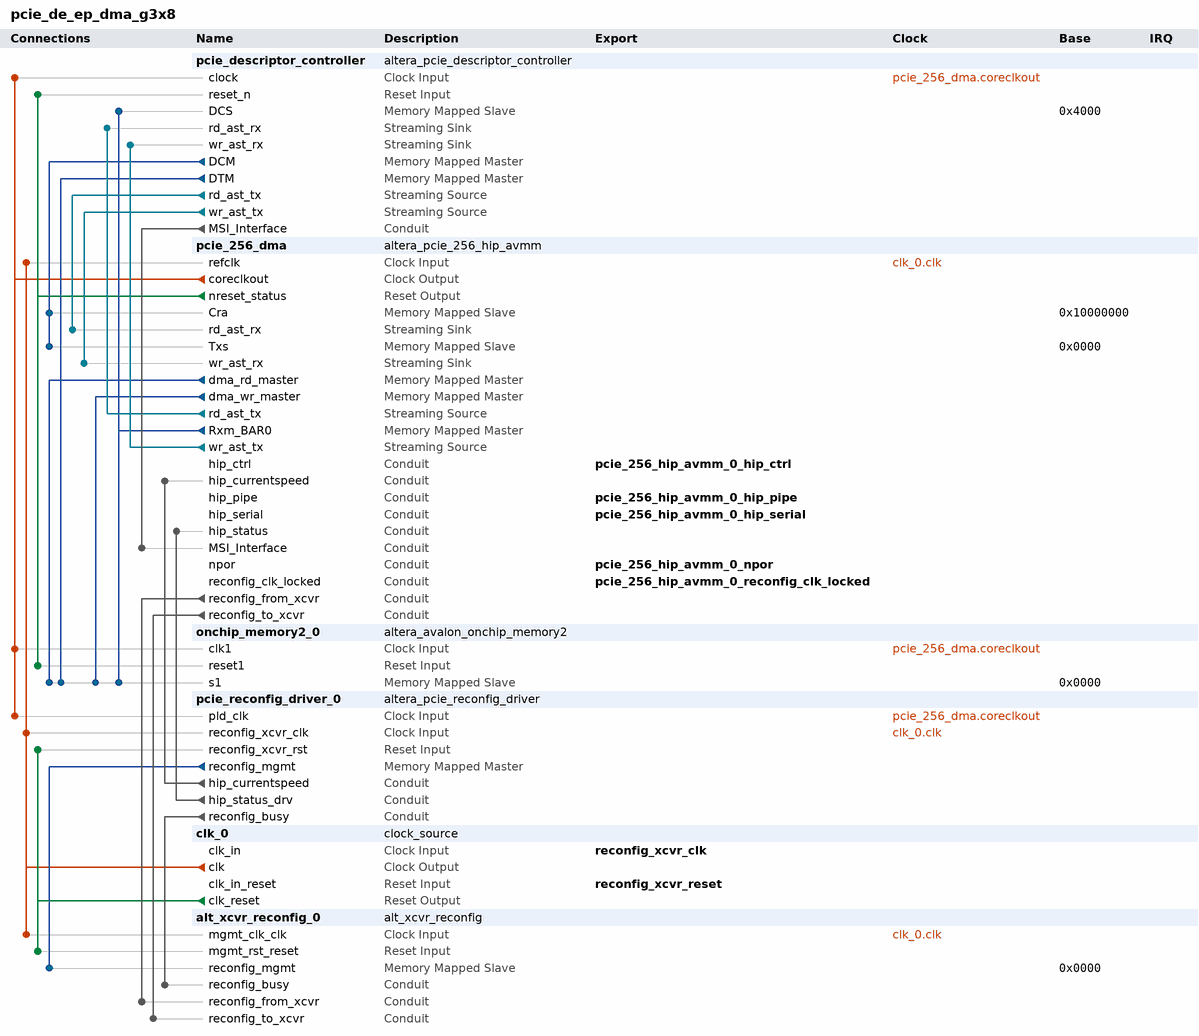
[diagram p0: system contents]
# Platform Designer (Qsys) system pcie_de_ep_dma_g3x8, Stratix V Unknown
# Parameters at their usual value, and those the tool derives, are not listed.
package require -exact qsys 13.1
create_system pcie_de_ep_dma_g3x8
set_project_property DEVICE_FAMILY {Stratix V}
set_project_property DEVICE Unknown

add_instance pcie_descriptor_controller altera_pcie_descriptor_controller 1.0

add_instance pcie_256_dma altera_pcie_256_hip_avmm 13.1
set_instance_parameter_value pcie_256_dma pcie_qsys 1
set_instance_parameter_value pcie_256_dma lane_mask_hwtcl x8
set_instance_parameter_value pcie_256_dma gen123_lane_rate_mode_hwtcl {Gen3 (8.0 Gbps)}
set_instance_parameter_value pcie_256_dma port_type_hwtcl {Native endpoint}
set_instance_parameter_value pcie_256_dma rxbuffer_rxreq_hwtcl Low
set_instance_parameter_value pcie_256_dma pll_refclk_freq_hwtcl {100 MHz}
set_instance_parameter_value pcie_256_dma set_pld_clk_x1_625MHz_hwtcl 0
set_instance_parameter_value pcie_256_dma in_cvp_mode_hwtcl 0
set_instance_parameter_value pcie_256_dma enable_tl_only_sim_hwtcl 0
set_instance_parameter_value pcie_256_dma use_atx_pll_hwtcl 0
set_instance_parameter_value pcie_256_dma SLAVE_ADDRESS_MAP_0 15
set_instance_parameter_value pcie_256_dma CB_P2A_AVALON_ADDR_B0 0x00000000
set_instance_parameter_value pcie_256_dma SLAVE_ADDRESS_MAP_1 0
set_instance_parameter_value pcie_256_dma CB_P2A_AVALON_ADDR_B1 0x00000000
set_instance_parameter_value pcie_256_dma SLAVE_ADDRESS_MAP_2 0
set_instance_parameter_value pcie_256_dma CB_P2A_AVALON_ADDR_B2 0x00000000
set_instance_parameter_value pcie_256_dma SLAVE_ADDRESS_MAP_3 0
set_instance_parameter_value pcie_256_dma CB_P2A_AVALON_ADDR_B3 0x00000000
set_instance_parameter_value pcie_256_dma SLAVE_ADDRESS_MAP_4 0
set_instance_parameter_value pcie_256_dma CB_P2A_AVALON_ADDR_B4 0x00000000
set_instance_parameter_value pcie_256_dma SLAVE_ADDRESS_MAP_5 0
set_instance_parameter_value pcie_256_dma CB_P2A_AVALON_ADDR_B5 0x00000000
set_instance_parameter_value pcie_256_dma RD_SLAVE_ADDRESS_MAP 14
set_instance_parameter_value pcie_256_dma WR_SLAVE_ADDRESS_MAP 14
set_instance_parameter_value pcie_256_dma NUM_PREFETCH_MASTERS 1
set_instance_parameter_value pcie_256_dma bar0_type_hwtcl 64
set_instance_parameter_value pcie_256_dma bar1_type_hwtcl 1
set_instance_parameter_value pcie_256_dma bar2_type_hwtcl 1
set_instance_parameter_value pcie_256_dma bar3_type_hwtcl 1
set_instance_parameter_value pcie_256_dma bar4_type_hwtcl 1
set_instance_parameter_value pcie_256_dma bar5_type_hwtcl 1
set_instance_parameter_value pcie_256_dma fixed_address_mode 0
set_instance_parameter_value pcie_256_dma CB_P2A_FIXED_AVALON_ADDR_B0 0
set_instance_parameter_value pcie_256_dma CB_P2A_FIXED_AVALON_ADDR_B1 0
set_instance_parameter_value pcie_256_dma CB_P2A_FIXED_AVALON_ADDR_B2 0
set_instance_parameter_value pcie_256_dma CB_P2A_FIXED_AVALON_ADDR_B3 0
set_instance_parameter_value pcie_256_dma CB_P2A_FIXED_AVALON_ADDR_B4 0
set_instance_parameter_value pcie_256_dma CB_P2A_FIXED_AVALON_ADDR_B5 0
set_instance_parameter_value pcie_256_dma vendor_id_hwtcl 0
set_instance_parameter_value pcie_256_dma device_id_hwtcl 1
set_instance_parameter_value pcie_256_dma revision_id_hwtcl 1
set_instance_parameter_value pcie_256_dma class_code_hwtcl 0
set_instance_parameter_value pcie_256_dma subsystem_vendor_id_hwtcl 0
set_instance_parameter_value pcie_256_dma subsystem_device_id_hwtcl 0
set_instance_parameter_value pcie_256_dma max_payload_size_hwtcl 128
set_instance_parameter_value pcie_256_dma extend_tag_field_hwtcl 32
set_instance_parameter_value pcie_256_dma completion_timeout_hwtcl ABCD
set_instance_parameter_value pcie_256_dma enable_completion_timeout_disable_hwtcl 1
set_instance_parameter_value pcie_256_dma use_aer_hwtcl 0
set_instance_parameter_value pcie_256_dma ecrc_check_capable_hwtcl 0
set_instance_parameter_value pcie_256_dma ecrc_gen_capable_hwtcl 0
set_instance_parameter_value pcie_256_dma use_crc_forwarding_hwtcl 0
set_instance_parameter_value pcie_256_dma port_link_number_hwtcl 1
set_instance_parameter_value pcie_256_dma dll_active_report_support_hwtcl 0
set_instance_parameter_value pcie_256_dma surprise_down_error_support_hwtcl 0
set_instance_parameter_value pcie_256_dma slotclkcfg_hwtcl 1
set_instance_parameter_value pcie_256_dma msi_multi_message_capable_hwtcl 1
set_instance_parameter_value pcie_256_dma msi_64bit_addressing_capable_hwtcl true
set_instance_parameter_value pcie_256_dma msi_masking_capable_hwtcl false
set_instance_parameter_value pcie_256_dma msi_support_hwtcl true
set_instance_parameter_value pcie_256_dma enable_function_msix_support_hwtcl 0
set_instance_parameter_value pcie_256_dma msix_table_size_hwtcl 0
set_instance_parameter_value pcie_256_dma msix_table_offset_hwtcl 0
set_instance_parameter_value pcie_256_dma msix_table_bir_hwtcl 0
set_instance_parameter_value pcie_256_dma msix_pba_offset_hwtcl 0
set_instance_parameter_value pcie_256_dma msix_pba_bir_hwtcl 0
set_instance_parameter_value pcie_256_dma enable_slot_register_hwtcl 0
set_instance_parameter_value pcie_256_dma slot_power_scale_hwtcl 0
set_instance_parameter_value pcie_256_dma slot_power_limit_hwtcl 0
set_instance_parameter_value pcie_256_dma slot_number_hwtcl 0
set_instance_parameter_value pcie_256_dma endpoint_l0_latency_hwtcl 0
set_instance_parameter_value pcie_256_dma endpoint_l1_latency_hwtcl 0
set_instance_parameter_value pcie_256_dma CG_COMMON_CLOCK_MODE 1
set_instance_parameter_value pcie_256_dma avmm_width_hwtcl 256
set_instance_parameter_value pcie_256_dma CG_RXM_IRQ_NUM 16
set_instance_parameter_value pcie_256_dma TX_S_ADDR_WIDTH 28
set_instance_parameter_value pcie_256_dma use_rx_st_be_hwtcl 0
set_instance_parameter_value pcie_256_dma use_ast_parity 0
set_instance_parameter_value pcie_256_dma hip_reconfig_hwtcl 0
set_instance_parameter_value pcie_256_dma vsec_id_hwtcl 40960
set_instance_parameter_value pcie_256_dma vsec_rev_hwtcl 0
set_instance_parameter_value pcie_256_dma expansion_base_address_register_hwtcl 0
set_instance_parameter_value pcie_256_dma io_window_addr_width_hwtcl 0
set_instance_parameter_value pcie_256_dma prefetchable_mem_window_addr_width_hwtcl 0
set_instance_parameter_value pcie_256_dma advanced_default_parameter_override 0
set_instance_parameter_value pcie_256_dma override_tbpartner_driver_setting_hwtcl 0
set_instance_parameter_value pcie_256_dma override_rxbuffer_cred_preset 0
set_instance_parameter_value pcie_256_dma gen3_rxfreqlock_counter_hwtcl 0
set_instance_parameter_value pcie_256_dma force_hrc 0
set_instance_parameter_value pcie_256_dma force_src 0
set_instance_parameter_value pcie_256_dma serial_sim_hwtcl 1
set_instance_parameter_value pcie_256_dma advanced_default_hwtcl_bypass_cdc false
set_instance_parameter_value pcie_256_dma advanced_default_hwtcl_enable_rx_buffer_checking false
set_instance_parameter_value pcie_256_dma advanced_default_hwtcl_disable_link_x2_support false
set_instance_parameter_value pcie_256_dma advanced_default_hwtcl_wrong_device_id disable
set_instance_parameter_value pcie_256_dma advanced_default_hwtcl_data_pack_rx disable
set_instance_parameter_value pcie_256_dma advanced_default_hwtcl_ltssm_1ms_timeout disable
set_instance_parameter_value pcie_256_dma advanced_default_hwtcl_ltssm_freqlocked_check disable
set_instance_parameter_value pcie_256_dma advanced_default_hwtcl_deskew_comma com_deskw
set_instance_parameter_value pcie_256_dma advanced_default_hwtcl_device_number 0
set_instance_parameter_value pcie_256_dma advanced_default_hwtcl_pipex1_debug_sel disable
set_instance_parameter_value pcie_256_dma advanced_default_hwtcl_pclk_out_sel pclk
set_instance_parameter_value pcie_256_dma advanced_default_hwtcl_no_soft_reset false
set_instance_parameter_value pcie_256_dma advanced_default_hwtcl_maximum_current 0
set_instance_parameter_value pcie_256_dma advanced_default_hwtcl_d1_support false
set_instance_parameter_value pcie_256_dma advanced_default_hwtcl_d2_support false
set_instance_parameter_value pcie_256_dma advanced_default_hwtcl_d0_pme false
set_instance_parameter_value pcie_256_dma advanced_default_hwtcl_d1_pme false
set_instance_parameter_value pcie_256_dma advanced_default_hwtcl_d2_pme false
set_instance_parameter_value pcie_256_dma advanced_default_hwtcl_d3_hot_pme false
set_instance_parameter_value pcie_256_dma advanced_default_hwtcl_d3_cold_pme false
set_instance_parameter_value pcie_256_dma advanced_default_hwtcl_low_priority_vc single_vc
set_instance_parameter_value pcie_256_dma advanced_default_hwtcl_disable_snoop_packet false
set_instance_parameter_value pcie_256_dma advanced_default_hwtcl_enable_l1_aspm false
set_instance_parameter_value pcie_256_dma advanced_default_hwtcl_set_l0s 0
set_instance_parameter_value pcie_256_dma advanced_default_hwtcl_l1_exit_latency_sameclock 0
set_instance_parameter_value pcie_256_dma advanced_default_hwtcl_l1_exit_latency_diffclock 0
set_instance_parameter_value pcie_256_dma advanced_default_hwtcl_hot_plug_support 0
set_instance_parameter_value pcie_256_dma advanced_default_hwtcl_extended_tag_reset false
set_instance_parameter_value pcie_256_dma advanced_default_hwtcl_no_command_completed true
set_instance_parameter_value pcie_256_dma advanced_default_hwtcl_interrupt_pin inta
set_instance_parameter_value pcie_256_dma advanced_default_hwtcl_bridge_port_vga_enable false
set_instance_parameter_value pcie_256_dma advanced_default_hwtcl_bridge_port_ssid_support false
set_instance_parameter_value pcie_256_dma advanced_default_hwtcl_ssvid 0
set_instance_parameter_value pcie_256_dma advanced_default_hwtcl_ssid 0
set_instance_parameter_value pcie_256_dma advanced_default_hwtcl_eie_before_nfts_count 4
set_instance_parameter_value pcie_256_dma advanced_default_hwtcl_gen2_diffclock_nfts_count 255
set_instance_parameter_value pcie_256_dma advanced_default_hwtcl_gen2_sameclock_nfts_count 255
set_instance_parameter_value pcie_256_dma advanced_default_hwtcl_l0_exit_latency_sameclock 6
set_instance_parameter_value pcie_256_dma advanced_default_hwtcl_l0_exit_latency_diffclock 6
set_instance_parameter_value pcie_256_dma advanced_default_hwtcl_atomic_op_routing false
set_instance_parameter_value pcie_256_dma advanced_default_hwtcl_atomic_op_completer_32bit false
set_instance_parameter_value pcie_256_dma advanced_default_hwtcl_atomic_op_completer_64bit false
set_instance_parameter_value pcie_256_dma advanced_default_hwtcl_cas_completer_128bit false
set_instance_parameter_value pcie_256_dma advanced_default_hwtcl_ltr_mechanism false
set_instance_parameter_value pcie_256_dma advanced_default_hwtcl_tph_completer false
set_instance_parameter_value pcie_256_dma advanced_default_hwtcl_extended_format_field false
set_instance_parameter_value pcie_256_dma advanced_default_hwtcl_atomic_malformed true
set_instance_parameter_value pcie_256_dma advanced_default_hwtcl_flr_capability false
set_instance_parameter_value pcie_256_dma advanced_default_hwtcl_enable_adapter_half_rate_mode false
set_instance_parameter_value pcie_256_dma advanced_default_hwtcl_vc0_clk_enable true
set_instance_parameter_value pcie_256_dma advanced_default_hwtcl_register_pipe_signals false
set_instance_parameter_value pcie_256_dma advanced_default_hwtcl_skp_os_gen3_count 0
set_instance_parameter_value pcie_256_dma advanced_default_hwtcl_tx_cdc_almost_empty 5
set_instance_parameter_value pcie_256_dma advanced_default_hwtcl_rx_l0s_count_idl 0
set_instance_parameter_value pcie_256_dma advanced_default_hwtcl_cdc_dummy_insert_limit 11
set_instance_parameter_value pcie_256_dma advanced_default_hwtcl_ei_delay_powerdown_count 10
set_instance_parameter_value pcie_256_dma advanced_default_hwtcl_skp_os_schedule_count 0
set_instance_parameter_value pcie_256_dma advanced_default_hwtcl_fc_init_timer 1024
set_instance_parameter_value pcie_256_dma advanced_default_hwtcl_l01_entry_latency 31
set_instance_parameter_value pcie_256_dma advanced_default_hwtcl_flow_control_update_count 30
set_instance_parameter_value pcie_256_dma advanced_default_hwtcl_flow_control_timeout_count 200
set_instance_parameter_value pcie_256_dma advanced_default_hwtcl_retry_buffer_last_active_address 2047
set_instance_parameter_value pcie_256_dma advanced_default_hwtcl_reserved_debug 0

add_instance onchip_memory2_0 altera_avalon_onchip_memory2 13.1
set_instance_parameter_value onchip_memory2_0 dataWidth 256
set_instance_parameter_value onchip_memory2_0 dualPort false
set_instance_parameter_value onchip_memory2_0 initMemContent false
set_instance_parameter_value onchip_memory2_0 initializationFileName onchip_mem
set_instance_parameter_value onchip_memory2_0 memorySize 16384

add_instance pcie_reconfig_driver_0 altera_pcie_reconfig_driver 1.0
set_instance_parameter_value pcie_reconfig_driver_0 gen123_lane_rate_mode_hwtcl {Gen3 (8.0 Gbps)}
set_instance_parameter_value pcie_reconfig_driver_0 number_of_reconfig_interfaces 11

add_instance clk_0 clock_source 13.1
set_instance_parameter_value clk_0 clockFrequency 100000000

add_instance alt_xcvr_reconfig_0 alt_xcvr_reconfig 13.1
set_instance_parameter_value alt_xcvr_reconfig_0 device_family {Stratix V}
set_instance_parameter_value alt_xcvr_reconfig_0 number_of_reconfig_interfaces 11
set_instance_parameter_value alt_xcvr_reconfig_0 enable_analog 1
set_instance_parameter_value alt_xcvr_reconfig_0 enable_adce 1

# connections
add_connection clk_0.clk alt_xcvr_reconfig_0.mgmt_clk_clk clock
add_connection clk_0.clk pcie_256_dma.refclk clock
add_connection clk_0.clk pcie_reconfig_driver_0.reconfig_xcvr_clk clock
add_connection pcie_256_dma.coreclkout onchip_memory2_0.clk1 clock
add_connection pcie_256_dma.coreclkout pcie_descriptor_controller.clock clock
add_connection pcie_256_dma.coreclkout pcie_reconfig_driver_0.pld_clk clock
add_connection clk_0.clk_reset alt_xcvr_reconfig_0.mgmt_rst_reset reset
add_connection clk_0.clk_reset pcie_reconfig_driver_0.reconfig_xcvr_rst reset
add_connection pcie_256_dma.nreset_status onchip_memory2_0.reset1 reset
add_connection pcie_256_dma.nreset_status pcie_descriptor_controller.reset_n reset
add_connection pcie_256_dma.dma_rd_master onchip_memory2_0.s1 avalon
set_connection_parameter_value pcie_256_dma.dma_rd_master/onchip_memory2_0.s1 baseAddress 0x0000
add_connection pcie_256_dma.dma_wr_master onchip_memory2_0.s1 avalon
set_connection_parameter_value pcie_256_dma.dma_wr_master/onchip_memory2_0.s1 baseAddress 0x0000
add_connection pcie_256_dma.Rxm_BAR0 onchip_memory2_0.s1 avalon
set_connection_parameter_value pcie_256_dma.Rxm_BAR0/onchip_memory2_0.s1 baseAddress 0x0000
add_connection pcie_256_dma.Rxm_BAR0 pcie_descriptor_controller.DCS avalon
set_connection_parameter_value pcie_256_dma.Rxm_BAR0/pcie_descriptor_controller.DCS baseAddress 0x4000
add_connection pcie_descriptor_controller.DCM pcie_256_dma.Cra avalon
set_connection_parameter_value pcie_descriptor_controller.DCM/pcie_256_dma.Cra baseAddress 0x10000000
add_connection pcie_descriptor_controller.DCM pcie_256_dma.Txs avalon
set_connection_parameter_value pcie_descriptor_controller.DCM/pcie_256_dma.Txs baseAddress 0x0000
add_connection pcie_descriptor_controller.DTM onchip_memory2_0.s1 avalon
set_connection_parameter_value pcie_descriptor_controller.DTM/onchip_memory2_0.s1 baseAddress 0x0000
add_connection pcie_reconfig_driver_0.reconfig_mgmt alt_xcvr_reconfig_0.reconfig_mgmt avalon
set_connection_parameter_value pcie_reconfig_driver_0.reconfig_mgmt/alt_xcvr_reconfig_0.reconfig_mgmt baseAddress 0x0000
add_connection pcie_256_dma.rd_ast_tx pcie_descriptor_controller.rd_ast_rx avalon_streaming
add_connection pcie_256_dma.wr_ast_tx pcie_descriptor_controller.wr_ast_rx avalon_streaming
add_connection pcie_descriptor_controller.rd_ast_tx pcie_256_dma.rd_ast_rx avalon_streaming
add_connection pcie_descriptor_controller.wr_ast_tx pcie_256_dma.wr_ast_rx avalon_streaming
add_connection pcie_256_dma.reconfig_from_xcvr alt_xcvr_reconfig_0.reconfig_from_xcvr conduit
add_connection pcie_256_dma.reconfig_to_xcvr alt_xcvr_reconfig_0.reconfig_to_xcvr conduit
add_connection pcie_descriptor_controller.MSI_Interface pcie_256_dma.MSI_Interface conduit
add_connection pcie_reconfig_driver_0.hip_currentspeed pcie_256_dma.hip_currentspeed conduit
add_connection pcie_reconfig_driver_0.hip_status_drv pcie_256_dma.hip_status conduit
add_connection pcie_reconfig_driver_0.reconfig_busy alt_xcvr_reconfig_0.reconfig_busy conduit

# exported interfaces
add_interface reconfig_xcvr_clk clock sink
set_interface_property reconfig_xcvr_clk EXPORT_OF clk_0.clk_in
add_interface reconfig_xcvr_reset reset sink
set_interface_property reconfig_xcvr_reset EXPORT_OF clk_0.clk_in_reset
add_interface pcie_256_hip_avmm_0_hip_ctrl conduit end
set_interface_property pcie_256_hip_avmm_0_hip_ctrl EXPORT_OF pcie_256_dma.hip_ctrl
add_interface pcie_256_hip_avmm_0_hip_pipe conduit end
set_interface_property pcie_256_hip_avmm_0_hip_pipe EXPORT_OF pcie_256_dma.hip_pipe
add_interface pcie_256_hip_avmm_0_hip_serial conduit end
set_interface_property pcie_256_hip_avmm_0_hip_serial EXPORT_OF pcie_256_dma.hip_serial
add_interface pcie_256_hip_avmm_0_reconfig_clk_locked conduit end
set_interface_property pcie_256_hip_avmm_0_reconfig_clk_locked EXPORT_OF pcie_256_dma.reconfig_clk_locked
add_interface pcie_256_hip_avmm_0_npor conduit end
set_interface_property pcie_256_hip_avmm_0_npor EXPORT_OF pcie_256_dma.npor

set_interconnect_requirement {$system} qsys_mm.clockCrossingAdapter HANDSHAKE
set_interconnect_requirement {$system} qsys_mm.maxAdditionalLatency 1

save_system pcie_de_ep_dma_g3x8.qsys
